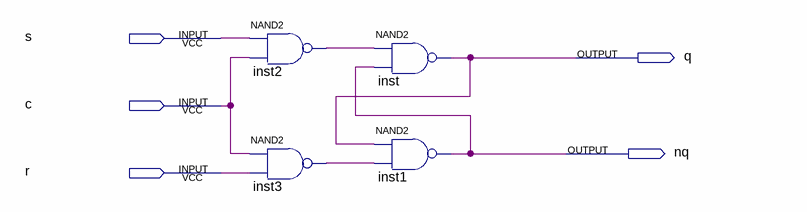
[diagram p0: schematic sheet]
// Quartus schematic s52_rs.bdf as structural Verilog: 4 symbols, 5 pins
module s52_rs (
  input  s,
  input  c,
  input  r,
  output q,
  output nq
);

  wire inst2_out, inst3_out;

  nand inst2 (inst2_out, s, c);
  nand inst3 (inst3_out, c, r);
  nand inst (q, inst2_out, nq);
  nand inst1 (nq, q, inst3_out);
endmodule
